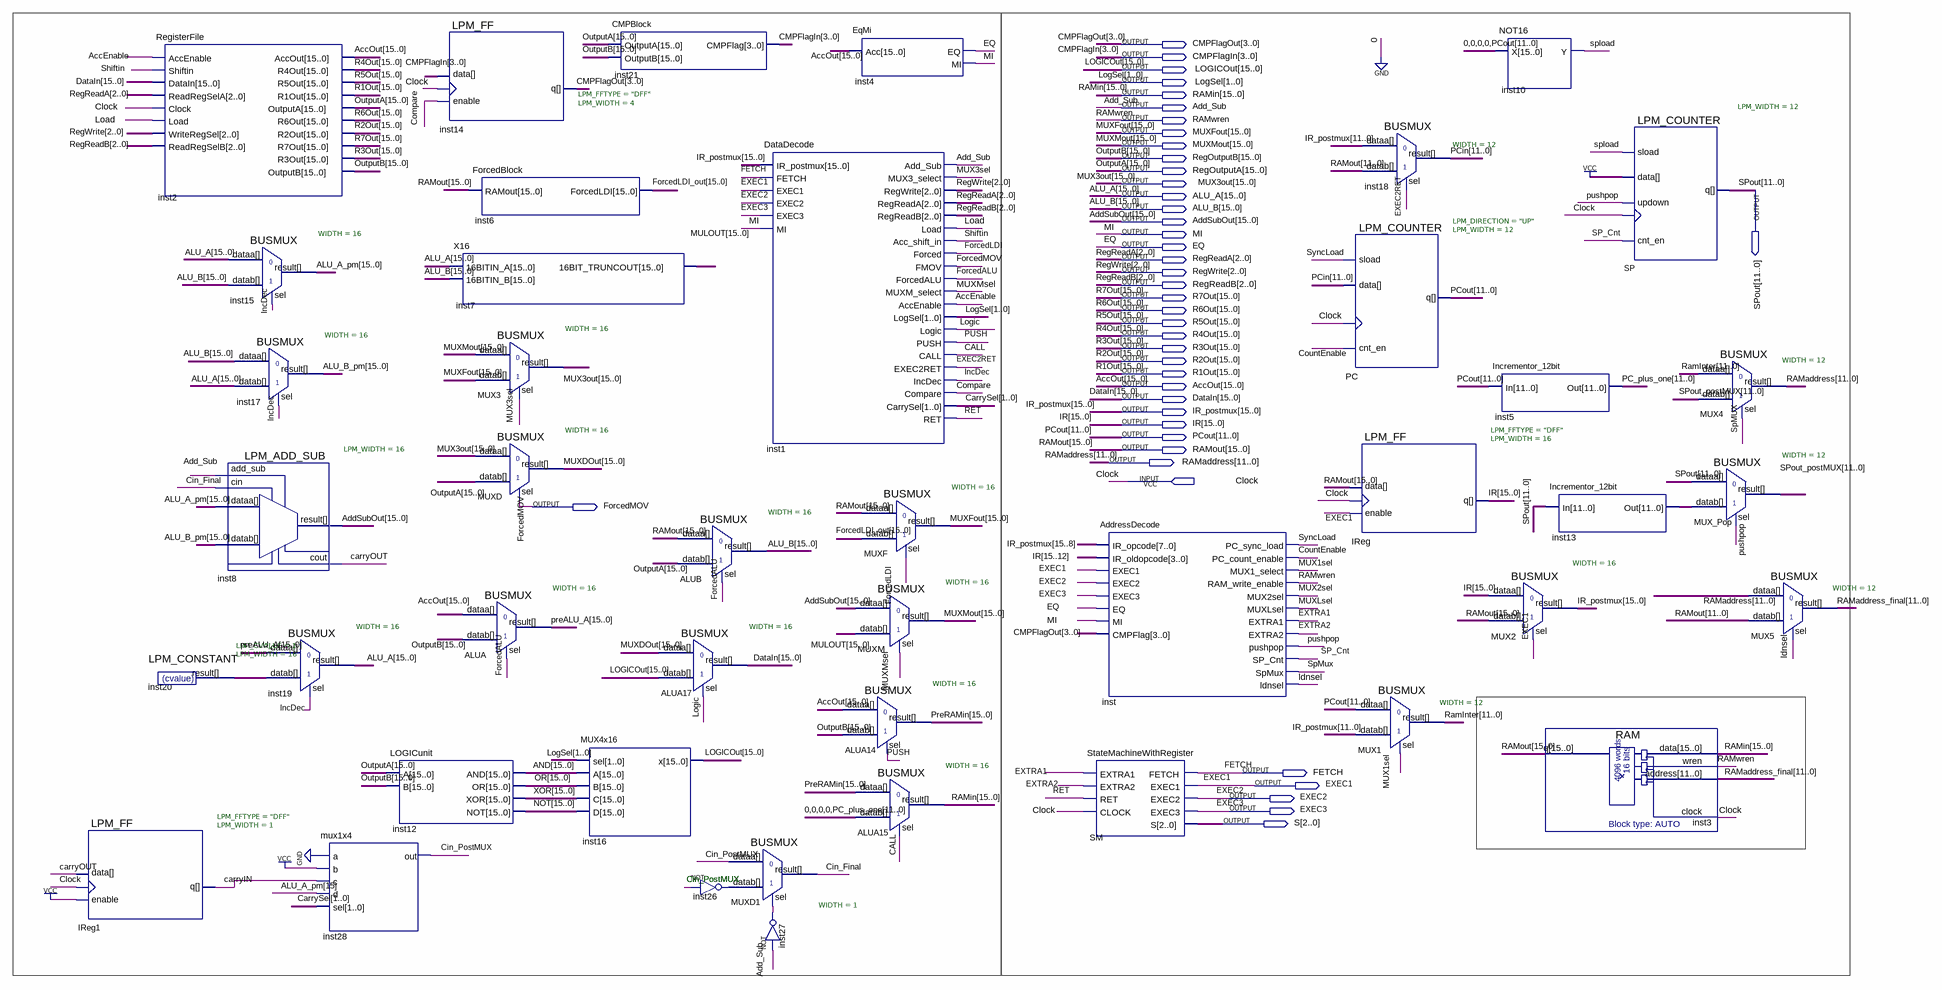
[diagram p0: schematic sheet]
// Quartus schematic SS1.bdf as structural Verilog: 43 symbols, 42 pins
module SS1 (
  input  Clock,
  output [3:0] CMPFlagOut,
  output [3:0] CMPFlagIn,
  output [15:0] LOGICOut,
  output [1:0] LogSel,
  output [15:0] RAMin,
  output Add_Sub,
  output RAMwren,
  output [15:0] MUXFout,
  output [15:0] MUXMout,
  output [15:0] RegOutputB,
  output [15:0] RegOutputA,
  output [15:0] MUX3out,
  output [11:0] SPout,
  output [15:0] ALU_A,
  output [15:0] ALU_B,
  output [15:0] AddSubOut,
  output MI,
  output EQ,
  output [2:0] RegReadA,
  output [2:0] RegWrite,
  output [2:0] RegReadB,
  output [15:0] R7Out,
  output [15:0] R6Out,
  output [15:0] R5Out,
  output [15:0] R4Out,
  output [15:0] R3Out,
  output [15:0] R2Out,
  output [15:0] R1Out,
  output [15:0] AccOut,
  output [15:0] DataIn,
  output [15:0] IR_postmux,
  output [15:0] IR,
  output [11:0] PCout,
  output [15:0] RAMout,
  output [11:0] RAMaddress,
  output ForcedMOV,
  output FETCH,
  output EXEC1,
  output EXEC2,
  output EXEC3,
  output [2:0] S
);

  wire AccEnable, CALL, carryIN, carryOUT, Cin_Final, Cin_PostMUX, Compare, CountEnable, EXEC2RET, EXTRA1,
       EXTRA2, ForcedALU, ForcedLDI, IncDec, inst26_out, inst27_out, ldnsel, Load, Logic, MUX1sel, MUX2sel,
       MUX3sel, MUXLsel, MUXMsel, PUSH, pushpop, RET, Shiftin, SP_Cnt, spload, SpMUX, SyncLoad;
  wire [1:0] CarrySel;
  wire [11:0] inst13_out, PC_plus_one, PCin, RAMaddress_final, RamInter, SPout_postMUX;
  wire [15:0] ALU_A_pm, ALU_B_pm, AND, ForcedLDI_out, inst20_result, MULOUT, MUXDOut, NOT, OR, preALU_A,
       PreRAMin, XOR;

  LPM_FF #(.LPM_FFTYPE("DFF"), .LPM_WIDTH(1)) IReg1 (.clock(Clock), .data(carryOUT), .enable(1'b1), .q(carryIN));
  LPM_CONSTANT #(.LPM_CVALUE(1), .LPM_WIDTH(16)) inst20 (.result(inst20_result));
  RegisterFile inst2 (
    .AccEnable(AccEnable), .Shiftin(Shiftin), .DataIn(DataIn), .ReadRegSelA(RegReadA), .Clock(Clock),
    .Load(Load), .WriteRegSel(RegWrite), .ReadRegSelB(RegReadB), .AccOut(AccOut), .R4Out(R4Out),
    .R5Out(R5Out), .R1Out(R1Out), .OutputA(RegOutputA), .R6Out(R6Out), .R2Out(R2Out), .R7Out(R7Out),
    .R3Out(R3Out), .OutputB(RegOutputB));
  BUSMUX #(.WIDTH(16)) inst15 (.datab(ALU_B), .sel(IncDec), .dataa(ALU_A), .result(ALU_A_pm));
  BUSMUX #(.WIDTH(16)) inst17 (.datab(ALU_A), .sel(IncDec), .dataa(ALU_B), .result(ALU_B_pm));
  LPM_ADD_SUB #(.LPM_WIDTH(16)) inst8 (
    .add_sub(Add_Sub), .cin(Cin_Final), .dataa(ALU_A_pm), .datab(ALU_B_pm), .cout(carryOUT),
    .result(AddSubOut));
  BUSMUX #(.WIDTH(16)) inst19 (.datab(inst20_result), .sel(IncDec), .dataa(preALU_A), .result(ALU_A));
  mux1x4 inst28 (.a(1'b0), .b(1'b1), .c(carryIN), .d(ALU_A_pm[15]), .sel(CarrySel), .out(Cin_PostMUX));
  LOGICunit inst12 (.A(RegOutputA), .B(RegOutputB), .AND(AND), .OR(OR), .XOR(XOR), .NOT(NOT));
  LPM_FF #(.LPM_FFTYPE("DFF"), .LPM_WIDTH(4)) inst14 (
    .clock(Clock), .data(CMPFlagIn), .enable(Compare), .q(CMPFlagOut));
  X16 inst7 (.\16BITIN_A (ALU_A), .\16BITIN_B (ALU_B), .\16BIT_TRUNCOUT (MULOUT));
  ForcedBlock inst6 (.RAMout(RAMout), .ForcedLDI(ForcedLDI_out));
  BUSMUX #(.WIDTH(16)) MUX3 (.datab(MUXFout), .sel(MUX3sel), .dataa(MUXMout), .result(MUX3out));
  BUSMUX #(.WIDTH(16)) MUXD (.datab(RegOutputA), .sel(ForcedMOV), .dataa(MUX3out), .result(MUXDOut));
  BUSMUX #(.WIDTH(16)) ALUA (.datab(RegOutputB), .sel(ForcedALU), .dataa(AccOut), .result(preALU_A));
  MUX4x16 inst16 (.sel(LogSel), .A(AND), .B(OR), .C(XOR), .D(NOT), .x(LOGICOut));
  CMPBlock inst21 (.OutputA(RegOutputA), .OutputB(RegOutputB), .CMPFlag(CMPFlagIn));
  BUSMUX #(.WIDTH(16)) ALUB (.datab(RegOutputA), .sel(ForcedALU), .dataa(RAMout), .result(ALU_B));
  BUSMUX #(.WIDTH(16)) ALUA17 (.datab(LOGICOut), .sel(Logic), .dataa(MUXDOut), .result(DataIn));
  not inst26 (inst26_out, Cin_PostMUX);
  BUSMUX #(.WIDTH(1)) MUXD1 (.datab(inst26_out), .sel(inst27_out), .dataa(Cin_PostMUX), .result(Cin_Final));
  DataDecode inst1 (
    .IR_postmux(IR_postmux), .FETCH(FETCH), .EXEC1(EXEC1), .EXEC2(EXEC2), .EXEC3(EXEC3), .MI(MI),
    .Add_Sub(Add_Sub), .MUX3_select(MUX3sel), .RegWrite(RegWrite), .RegReadA(RegReadA), .RegReadB(RegReadB),
    .Load(Load), .Acc_shift_in(Shiftin), .Forced(ForcedLDI), .FMOV(ForcedMOV), .ForcedALU(ForcedALU),
    .MUXM_select(MUXMsel), .AccEnable(AccEnable), .LogSel(LogSel), .Logic(Logic), .PUSH(PUSH), .CALL(CALL),
    .EXEC2RET(EXEC2RET), .IncDec(IncDec), .Compare(Compare), .CarrySel(CarrySel), .RET(RET));
  not inst27 (inst27_out, Add_Sub);
  EqMi inst4 (.Acc(AccOut), .EQ(EQ), .MI(MI));
  BUSMUX #(.WIDTH(16)) MUXM (.datab(MULOUT), .sel(MUXMsel), .dataa(AddSubOut), .result(MUXMout));
  BUSMUX #(.WIDTH(16)) ALUA14 (.datab(RegOutputB), .sel(PUSH), .dataa(AccOut), .result(PreRAMin));
  BUSMUX #(.WIDTH(16)) ALUA15 (.datab({4'b0000, PC_plus_one}), .sel(CALL), .dataa(PreRAMin), .result(RAMin));
  BUSMUX #(.WIDTH(16)) MUXF (.datab(ForcedLDI_out), .sel(ForcedLDI), .dataa(RAMout), .result(MUXFout));
  AddressDecode inst (
    .IR_opcode(IR_postmux[15:8]), .IR_oldopcode(IR[15:12]), .EXEC1(EXEC1), .EXEC2(EXEC2), .EXEC3(EXEC3),
    .EQ(EQ), .MI(MI), .CMPFlag(CMPFlagOut), .PC_sync_load(SyncLoad), .PC_count_enable(CountEnable),
    .MUX1_select(MUX1sel), .RAM_write_enable(RAMwren), .MUX2sel(MUX2sel), .MUXLsel(MUXLsel), .EXTRA1(EXTRA1),
    .EXTRA2(EXTRA2), .pushpop(pushpop), .SP_Cnt(SP_Cnt), .SpMux(SpMUX), .ldnsel(ldnsel));
  StateMachineWithRegister SM (
    .EXTRA1(EXTRA1), .EXTRA2(EXTRA2), .RET(RET), .CLOCK(Clock), .FETCH(FETCH), .EXEC1(EXEC1), .EXEC2(EXEC2),
    .EXEC3(EXEC3), .S(S));
  BUSMUX #(.WIDTH(12)) inst18 (.datab(RAMout[11:0]), .sel(EXEC2RET), .dataa(IR_postmux[11:0]), .result(PCin));
  LPM_COUNTER #(.LPM_DIRECTION("UP"), .LPM_WIDTH(12)) PC (
    .clock(Clock), .cnt_en(CountEnable), .data(PCin), .sload(SyncLoad), .q(PCout));
  LPM_FF #(.LPM_FFTYPE("DFF"), .LPM_WIDTH(16)) IReg (.clock(Clock), .data(RAMout), .enable(EXEC1), .q(IR));
  BUSMUX #(.WIDTH(12)) MUX1 (.datab(IR_postmux[11:0]), .sel(MUX1sel), .dataa(PCout), .result(RamInter));
  NOT16 inst10 (.X({4'b0000, PCout}), .Y(spload));
  Incrementor_12bit inst5 (.In(PCout), .Out(PC_plus_one));
  BUSMUX #(.WIDTH(16)) MUX2 (.datab(RAMout), .sel(EXEC1), .dataa(IR), .result(IR_postmux));
  Incrementor_12bit inst13 (.In(SPout), .Out(inst13_out));
  RAM inst3 (.data(RAMin), .wren(RAMwren), .address(RAMaddress_final), .clock(Clock), .q(RAMout));
  LPM_COUNTER #(.LPM_WIDTH(12)) SP (
    .clock(Clock), .cnt_en(SP_Cnt), .data({12{1'b1}}), .sload(spload), .updown(pushpop), .q(SPout));
  BUSMUX #(.WIDTH(12)) MUX4 (.datab(SPout_postMUX), .sel(SpMUX), .dataa(RamInter), .result(RAMaddress));
  BUSMUX #(.WIDTH(12)) MUX_Pop (.datab(inst13_out), .sel(pushpop), .dataa(SPout), .result(SPout_postMUX));
  BUSMUX #(.WIDTH(12)) MUX5 (.datab(RAMout[11:0]), .sel(ldnsel), .dataa(RAMaddress), .result(RAMaddress_final));

  // Other names for the same wires on the sheet: OutputA[15:0] = RegOutputA; OutputB[15:0] = RegOutputB

  // Notes on the sheet:
  //    Cin_PostMUX
endmodule
